# EasyEDA Pro project 一体板.epro, board PCB1
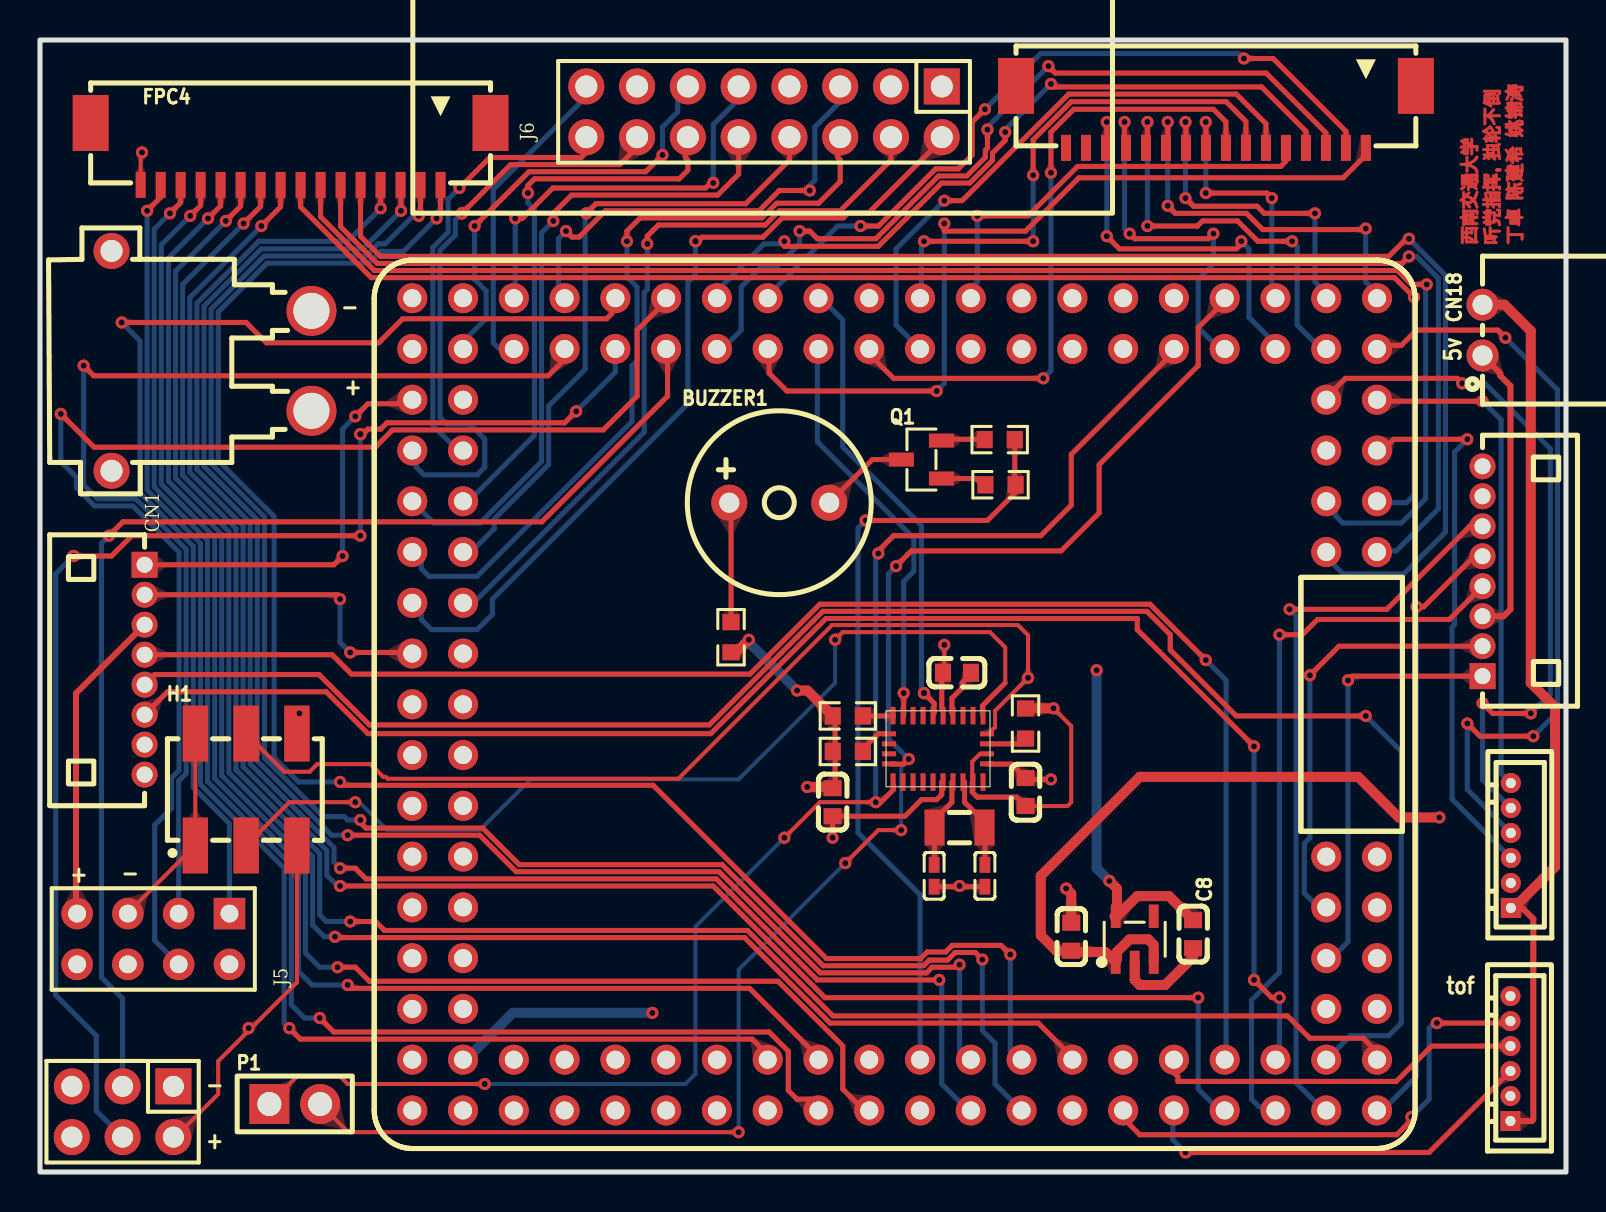
[diagram p7: board, top side]
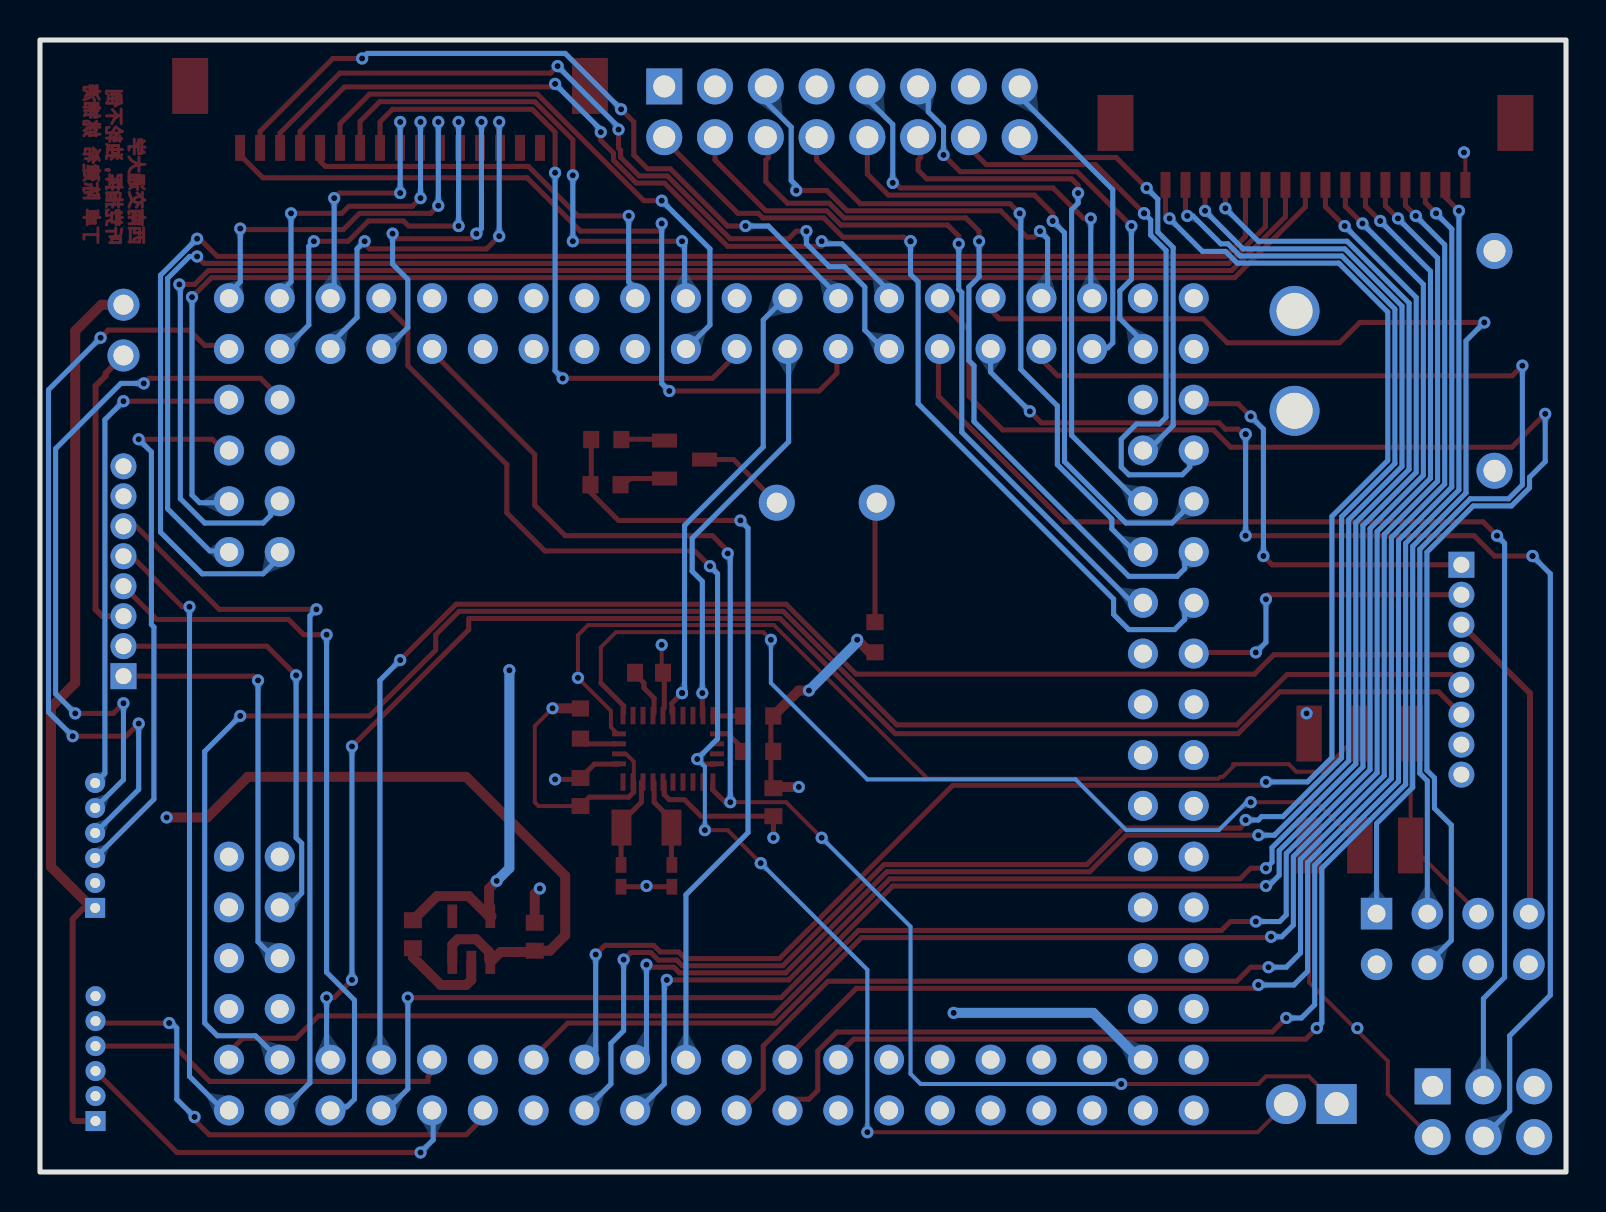
[diagram p8: board, bottom side, seen from below]

Outline 76.34 x 56.64 mm; copper layers: Top Layer, Inner1, Inner2, Bottom Layer. Coordinates in mm from the lower left corner of the outline.
Outline path: rectangle 0,56.64 76.34,0
Stack: Top Layer 0.035mm / Dielectric1 0.48mm PP er 4.5 / Inner1 0.035mm / Dielectric2 0.48mm FR4 er 4.5 / Inner2 0.035mm / Dielectric3 0.48mm PP er 4.5 / Bottom Layer 0.035mm

## Design rules (mm)
template: 自定义配置
spacing copperThickness1oz (default): track to track 0.102, other pairs 0.152 to 0.3
spacing copperThickness2oz: track to track 0.203, other pairs 0.152 to 0.3
track width copperThickness1oz (default): min 0.127, default 0.254, max 2.54
track width copperThickness2oz: min 0.203, default 0.254, max 2.54
differential pair differentialPair (default): width min 0.127, default 0.254, max 2.54; gap min 0.152, default 0.152
via viaSize (default): diameter min 0.5, default 0.61, max 10; hole min 0.3, default 0.305, max 6.3

## Placement (name value [footprint] x y rotation side)
BUZZER1  3kHz  [BUZ-TH_BD9.0-P5.00-D0.6-FD]  36.98 33.49 0 top
C1  22pF  [C0402]  47.27 14.82 90 top
C2  22pF  [C0402]  44.73 14.82 90 top
C3  100nF  [C0603]  45.87 24.98 0 top
C4  100nF  [C0603]  39.65 18.5 270 top
C5  100nF  [C0603]  49.3 19.01 90 top
C7  1uF  [C0603]  51.59 11.77 270 top
C8  1uF  [C0603]  57.68 11.9 270 top
CN1  HC-ZH1.5-8AW  [CONN-TH_8P-P1.50_HCTL_HC-ZH1.5-8AW]  5.23 25.13 270 top
CN6  HC-ZH1.5-8AW  [CONN-TH_8P-P1.50_HCTL_HC-ZH1.5-8AW]  72.16 30.06 90 top
CN13  HC-1.25-6A  [CONN-TH_6P-P1.25_HCTL_HC-1.25-6A]  73.58 16.34 90 top
CN15  HC-1.25-6A  [CONN-TH_6P-P1.25_HCTL_HC-1.25-6A]  73.56 5.68 90 top
CN16  XT30PW-M  [CONN-TH_XT30PW-M]  8.58 40.59 270 top
CN18  XH-2AW  [CONN-TH_XH-2AW_C2908611]  72.16 42.12 90 top
FPC3  F1004-H-16-20G-R  [CONN-SMD_F1004-H-16-20G-R]  58.82 52.79 180 top
FPC4  F1004-H-16-20G-R  [CONN-SMD_F1004-H-16-20G-R]  12.54 50.94 180 top
H1  X6521WVS-2x03H-C60D74  [HDR-SMD_6P-P2.54-V-M-R2-C5-S7.4]  10.31 19.14 0 top
J1  有刷电机编码器  [HDR-TH_6P-P2.54-V-M-R2-C3-S2.54-1]  4.13 3.02 180 top
J5  HDR-M-2.54_2x4  [HDR-M-2.54_2X4]  5.67 11.66 180 top
J6  2.54-2*8P母  [HDR-TH_16P-P2.54-V-F-R2-C8-S2.54-1]  36.22 53.05 180 top
P1  -  [HDR-TH_2P-P2.54-V-F]  12.74 3.4 0 top
Q1  S9013-G  [SOT-23-3_L2.9-W1.3-P1.90-LS2.4-BR]  44.09 35.65 0 top
R4  0603WAF4701T5E  [R0603]  48.05 34.39 180 top
R27  0603WAF100JT5E  [R0603]  34.57 26.76 90 top
R28  10kΩ  [R0603]  48.01 36.65 180 top
R29  2.2kΩ  [R0603]  40.41 22.82 180 top
R30  2.2kΩ  [R0603]  40.41 21.04 180 top
R31  2.2kΩ  [R0603]  49.3 22.44 90 top
U1  TC387核心板 COPY  [TC264逐飞]  37.67 24.04 90 top
U2  -  [lga_28]  47.52 23.07 270 top
U3  RT9013-33GB  [SOT-23-5_L3.0-W1.7-P0.95-LS2.8-BL]  54.76 11.64 0 top
X1  32.768kHz  [FC-135R_L3.2-W1.5]  46 17.23 180 top

## Footprints (pads in the part's own frame, mm; a bottom-side part is the same pattern mirrored in y, then rotated)
BUZ-TH_BD9.0-P5.00-D0.6-FD
  round 1.801 hole 1.001: 1(-2.499,0) 2(2.499,0)
C0402
  rect 0.79x0.54 smd: 1(-0.545,0) 2(0.545,0)
C0603
  rect 0.8x0.9 smd: 1(-0.7,0) 2(0.7,0)
CONN-SMD_F1004-H-16-20G-R
  rect 0.5x1.3 smd: 1(-7.5,1.55) 2(-6.5,1.55) 3(-5.5,1.55) 4(-4.5,1.55) 5(-3.5,1.55) 6(-2.5,1.55) 7(-1.5,1.55) 8(-0.5,1.55) 9(0.5,1.55) 10(1.5,1.55) 11(2.5,1.55) 12(3.5,1.55) 13(4.5,1.55) 14(5.5,1.55) 15(6.5,1.55) 16(7.5,1.55)
  rect 1.8x2.8 smd: 17(10,-1.55) 18(-10,-1.55)
CONN-TH_6P-P1.25_HCTL_HC-1.25-6A
  rect 1x1 hole 0.5: 1(-3.125,0)
  round 1 hole 0.5: 2(-1.875,0) 3(-0.625,0) 4(0.625,0) 5(1.875,0) 6(3.125,0)
CONN-TH_8P-P1.50_HCTL_HC-ZH1.5-8AW
  rect 1.3x1.3 hole 0.8: 1(-5.25,0)
  round 1.3 hole 0.8: 2(-3.75,0) 3(-2.25,0) 4(-0.75,0) 5(0.75,0) 6(2.25,0) 7(3.75,0) 8(5.25,0)
CONN-TH_XH-2AW_C2908611
  round 1.6 hole 1: 1(-1.27,0) 2(1.27,0)
CONN-TH_XT30PW-M
  round 2.5 hole 1.8: 1(-2.5,5) 2(2.5,5)
  round 1.8 hole 1.1: 3(5.5,-5) 4(-5.5,-5)
FC-135R_L3.2-W1.5
  rect 1x1.8 smd: 1(-1.25,0) 2(1.25,0)
HDR-M-2.54_2X4
  rect 1.575x1.575 hole 0.889: 1(-3.81,-1.27)
  round 1.575 hole 0.889: 2(-3.81,1.27) 3(-1.27,-1.27) 4(-1.27,1.27) 5(1.27,-1.27) 6(1.27,1.27) 7(3.81,-1.27) 8(3.81,1.27)
HDR-SMD_6P-P2.54-V-M-R2-C5-S7.4
  rect 1.27x2.8 smd: 1(-2.54,-2.8) 2(-2.54,2.8) 3(0,-2.8) 4(0,2.8) 5(2.54,-2.8) 6(2.54,2.8)
HDR-TH_2P-P2.54-V-F
  rect 1.999x1.999 hole 1.199: 1(-1.27,0)
  round 1.999 hole 1.199: 2(1.27,0)
HDR-TH_6P-P2.54-V-M-R2-C3-S2.54-1
  rect 1.801x1.801 hole 1.049: 1(-2.54,-1.27)
  round 1.801 hole 1.049: 2(-2.54,1.27) 3(0,-1.27) 4(0,1.27) 5(2.54,-1.27) 6(2.54,1.27)
HDR-TH_16P-P2.54-V-F-R2-C8-S2.54-1
  rect 1.8x1.8 hole 1.1: 1(-8.89,-1.27)
  round 1.8 hole 1.1: 2(-8.89,1.27) 3(-6.35,-1.27) 4(-6.35,1.27) 5(-3.81,-1.27) 6(-3.81,1.27) 7(-1.27,-1.27) 8(-1.27,1.27) 9(1.27,-1.27) 10(1.27,1.27) 11(3.81,-1.27) 12(3.81,1.27) 13(6.35,-1.27) 14(6.35,1.27) 15(8.89,-1.27) 16(8.89,1.27)
lga_28
  custom 0.875x0.25 smd: 1(3.562,-0.35) 6(0.237,-0.35) 7(0.237,-0.85) 8(0.237,-1.35) 9(0.237,-1.85) 10(0.237,-2.35) 11(0.237,-2.85) 12(0.237,-3.35) 13(0.237,-3.85) 14(0.237,-4.35) 15(0.237,-4.85) 20(3.562,-4.85) 21(3.562,-4.35) 22(3.562,-3.85) 23(3.562,-3.35) 24(3.562,-2.85) 25(3.562,-2.35) 26(3.562,-1.85) 27(3.562,-1.35) 28(3.562,-0.85)
  custom 0.25x0.7 smd: 2(2.65,-0.15) 3(2.15,-0.15) 4(1.65,-0.15) 5(1.15,-0.15) 16(1.15,-5.05) 17(1.65,-5.05) 18(2.15,-5.05) 19(2.65,-5.05)
R0603
  rect 0.806x0.864 smd: 1(-0.753,0) 2(0.753,0)
SOT-23-3_L2.9-W1.3-P1.90-LS2.4-BR
  rect 1.25x0.7 smd: 1(1,-0.95) 2(1,0.95) 3(-1,0)
SOT-23-5_L3.0-W1.7-P0.95-LS2.8-BL
  rect 0.49x1.157 smd: 1(-0.95,-1.153) 2(0,-1.153) 3(0.95,-1.153)
  rect 0.49x1.175 smd: 4(0.95,1.153) 5(-0.95,1.153)
TC264逐飞
  round 1.5 hole 0.9: 1(-20.955,19.05) 2(-18.415,19.05) 3(-20.955,16.51) 4(-18.415,16.51) 5(-20.955,13.97) 6(-18.415,13.97) 7(-20.955,11.43) 8(-18.415,11.43) 9(-20.955,8.89) 10(-18.415,8.89) 11(-20.955,6.35) 12(-18.415,6.35) 13(-20.955,3.81) 14(-18.415,3.81) 15(-20.955,1.27) 16(-18.415,1.27) 17(-20.955,-1.27) 18(-18.415,-1.27) 19(-20.955,-3.81) 20(-18.415,-3.81) 21(-20.955,-6.35) 22(-18.415,-6.35) 23(-20.955,-8.89) 24(-18.415,-8.89) 25(-20.955,-11.43) 26(-18.415,-11.43) 27(-20.955,-13.97) 28(-18.415,-13.97) 29(-20.955,-16.51) 30(-18.415,-16.51) 31(-20.955,-19.05) 32(-18.415,-19.05) 33(-20.955,-21.59) 34(-18.415,-21.59) 35(-20.955,-24.13) 36(-18.415,-24.13) 37(-20.955,-26.67) 38(-18.415,-26.67) 39(-20.955,-29.21) 40(-18.415,-29.21) 41(-15.875,-29.21) 42(-15.875,-26.67) 43(-13.335,-29.21) 44(-13.335,-26.67) 45(-10.795,-29.21) 46(-10.795,-26.67) 47(-8.255,-29.21) 48(-8.255,-26.67) 49(6.985,-26.67) 50(6.985,-29.21) 51(9.525,-26.67) 52(9.525,-29.21) 53(12.065,-26.67) 54(12.065,-29.21) 55(14.605,-26.67) 56(14.605,-29.21) 57(17.145,-29.21) 58(19.685,-29.21) 59(17.145,-26.67) 60(19.685,-26.67) 61(17.145,-24.13) 62(19.685,-24.13) 63(17.145,-21.59) 64(19.685,-21.59) 65(17.145,-19.05) 66(19.685,-19.05) 67(17.145,-16.51) 68(19.685,-16.51) 69(17.145,-13.97) 70(19.685,-13.97) 71(17.145,-11.43) 72(19.685,-11.43) 73(17.145,-8.89) 74(19.685,-8.89) 75(17.145,-6.35) 76(19.685,-6.35) 77(17.145,-3.81) 78(19.685,-3.81) 79(17.145,-1.27) 80(19.685,-1.27) 81(17.145,1.27) 82(19.685,1.27) 83(17.145,3.81) 84(19.685,3.81) 85(17.145,6.35) 86(19.685,6.35) 87(17.145,8.89) 88(19.685,8.89) 89(17.145,11.43) 90(19.685,11.43) 91(17.145,13.97) 92(19.685,13.97) 93(17.145,16.51) 94(19.685,16.51) 95(17.145,19.05) 96(19.685,19.05) 97(14.605,16.51) 98(14.605,19.05) 99(12.065,16.51) 100(12.065,19.05) 101(9.525,16.51) 102(9.525,19.05) 103(6.985,16.51) 104(6.985,19.05) 105(4.445,16.51) 106(4.445,19.05) 107(1.905,16.51) 108(1.905,19.05) 109(-0.635,16.51) 110(-0.635,19.05) 111(-3.175,16.51) 112(-3.175,19.05) 113(-5.715,16.51) 114(-5.715,19.05) 115(-8.255,16.51) 116(-8.255,19.05) 117(-10.795,16.51) 118(-10.795,19.05) 119(-13.335,16.51) 120(-13.335,19.05) 121(-15.875,16.51) 122(-15.875,19.05)

## Nets
As in the schematic.

Pads without a net: CN15 6; CN16 3 4; FPC3 15 16 17 18; FPC4 17 18; J1 5 6; J5 2 8; J6 7; U1 5 6 7 8 9 10 11 12 13 14 15 20 21 27 30 41 42 43 45 47 48 53 66 67 68 69 70 71 72 73 78 94 95 96 97 107 109 110 111 112 113 114 115 116 117 118 119 120 121 122; U2 1 7 8 12 13 17 18 21 22 23 24; U3 4

## Via types
v1: diameter 0.61, hole 0.305, Top Layer to Bottom Layer, 167 vias

## Routing (per net, layer and track width the routed paths; a pad name or vN(x,y) marks a point on that pad's centre or on a via; arc(x,y) is an arc through that point)
3.3V_LDO: length 212.4
  Top Layer w0.2: v1(50.7,23.2) 51.59,22.31 51.59,18.5 51.39,18.31 C5.1 ; v1(12.98,22.95) 12.98,22.06 H1.6 ; 7.01,1.99 8.91,3.9 8.91,5.55 12.85,9.49 H1.5 ; 46.63,19.65 46.63,20.53 47.01,20.92 47.39,20.92
  Top Layer w0.254: 39.77,22.95 39.77,19.33 C4.1 ; C5.1 48.85,18.76 46.89,18.76 46.63,19.01 46.63,19.52
  Top Layer w0.3: CN15.1 74.62,2.55 74.7,2.63 74.7,12.66 74.19,13.17 73.68,13.17
  Top Layer w0.5: v1(38.38,19.26) 39.59,19.26 C4.1 ; CN18.2 73.26,43.39 74.57,42.08 74.57,24.47 75.79,23.26 75.79,15.27 73.81,13.3 ; v1(50.7,23.2) 49.3,23.2 ; 34.57,25.87 34.69,25.87 v1(35.46,26.63) ; v1(37.87,24.09) 38.39,24.09 R29.2
  Inner1 w0.2: v1(12.98,22.95) 12.98,9.74 v1(10.44,7.2)
  Inner1 w0.5: 6.63,1.74 7.26,1.1 26.82,1.1 27.58,1.87 27.58,8.47 v1(38.38,19.26) 42.06,22.95 46.38,22.95 46.76,22.57 47.65,22.57 48.28,23.2 v1(50.7,23.2)
  Inner1 w0.8: CN18.2 73.26,43.39 74.39,42.26 74.39,24.54 73.56,23.71 73.56,21.68 72.03,20.15 57.81,20.15 54.76,23.2 v1(50.7,23.2)
  Bottom Layer w0.5: v1(37.87,24.09) 35.46,26.5 v1(35.46,26.63)
3.3V_LDO_CAMERA: length 51.3
  Top Layer w0.5: C8.1 56.48,13.8 54.89,13.8 53.87,12.79 53.74,12.79 ; v1(53.49,14.57) 53.87,14.18 53.87,13.04
  Inner1 w0.5: v1(52.86,25.11) 52.86,44.92 52.35,45.43 52.35,49.74 47.78,54.32 J6.1
  Bottom Layer w0.5: v1(52.86,25.11) 52.86,15.2 v1(53.49,14.57)
5V_DCDC: length 289.5
  Top Layer w0.3: 1.8,12.66 1.8,23.95 CN1.3 ; CN6.3 73.21,27.81 73.56,28.15 73.56,39.33 73.05,39.84 73.05,39.97 72.41,40.6
  Top Layer w0.5: U3.1 53.29,11.01 51.71,11.01 ; v1(70,17.74) 67.97,17.74 65.94,19.77 55.01,19.77 50.06,14.82 50.06,11.84 50.83,11.07 C7.2 ; 53.87,10.63 53.87,11.01 54.51,11.64 55.44,11.64 55.71,11.37 U3.3
  Inner1 w0.5: 2.31,12.66 3.2,11.77 3.2,7.71 5.29,5.62 U1.2 21.11,5.62 ; 21.09,5.55 U1.4 21.11,5.68
  Inner1 w0.8: v1(30.63,7.96) 30.93,7.96 34.94,11.97 56.86,11.97 62.63,17.74 v1(70,17.74)
  Inner2 w0.5: CN18.1 71.65,40.85 70.37,42.13 70.37,46.7 69.24,47.84 68.35,47.84 66.83,46.32 66.83,45.43 52.6,45.43 48.41,49.62 45.11,49.62 43.84,48.35 30.63,48.35 28.98,50 2.56,50 1.17,48.6 1.17,39.71 2.18,38.7 2.18,37.04 0.91,35.77 0.91,13.87 J5.7
  Inner2 w0.8: CN18.1 75.64,37.38 75.64,20.52 72.14,20.52 71.02,19.39 71.02,18.76 v1(70,17.74)
  Bottom Layer w0.5: 21.36,5.68 23.65,7.96 v1(30.63,7.96)
GND: length 37.5
  Top Layer w0.2: C3.1 45.24,25.04 v1(45.24,26.38) ; H1.1 7.77,16.34 ; 7.77,16.34 4.4,12.97 J5.5 ; 7.77,16.34 7.77,21.8 ; FPC4.16 5.04,50.95 v1(5.1,51.01)
  Top Layer w0.254: C2.1 47.18,14.27 47.27,14.18 ; 45.11,36.66 47.24,36.66 R28.2 ; 45.11,23.2 45.11,24.98 ; 47.39,20.41 48.6,20.41 C5.2 49.36,19.65 v1(50.57,19.65) ; 45.11,19.52 45.11,18.88 44.85,18.63 44.09,18.63 43.27,17.8 C4.2 v1(39.65,16.72)
  Top Layer w0.5: C7.1 51.59,13.93 v1(51.33,14.18) ; 57.68,11.01 57.68,10.76 56.28,9.36 55.01,9.36 54.76,9.61 U3.2
  vias: v1(46,14.31)
10.2: length 67.8
  Top Layer w0.254: 31.14,43.39 29.87,42.12 29.87,38.82 28.18,37.13 17.63,37.13 16.77,36.26 2.71,36.26 v1(1.04,37.93)
  Bottom Layer w0.254: v1(1.04,37.93) 1.04,35.55 1.83,34.76 1.83,34.23 2.73,33.33 4.64,33.33 6.96,31.01 6.96,20.1 6.58,19.72 6.58,18.2 5.74,17.36 5.74,11.59 v1(6.94,10.39)
10.5: length 57.9
  Top Layer w0.254: v1(4.09,42.51) 10.31,42.51 11.33,41.49 16.94,41.49 18.15,42.69 28.34,42.69 28.6,42.95 28.6,43.52
  Bottom Layer w0.254: v1(4.09,42.51) 5,41.59 5,33.98 7.67,31.31 7.67,19.24 9.48,17.44 v1(9.48,12.93)
10.6: length 55.2
  Top Layer w0.254: v1(2.18,40.35) 2.69,39.84 25.42,39.84 26.06,40.47
  Bottom Layer w0.254: v1(2.18,40.35) 2.18,34.38 2.88,33.68 4.79,33.68 7.31,31.16 7.31,19.95 6.94,19.57 v1(6.94,12.93)
20.11: length 27.1
  Top Layer w0.254: v1(71.4,36.66) 67.71,36.66 67.08,36.03
  Bottom Layer w0.254: v1(71.4,36.66) 70.76,36.03 70.76,27.39 70.64,27.27 70.64,18.65 v1(73.58,15.71)
20.12: length 35.4
  Top Layer w0.254: 64.16,38.57 65.3,39.71 70.89,39.71 v1(71.14,39.46) ; v1(72.16,23.46) 72.67,22.95 v1(74.57,22.95)
  Bottom Layer w0.254: v1(72.16,23.46) 72.16,19.63 v1(73.58,18.21) ; v1(71.14,39.46) 72.29,39.46 75.55,36.19 75.55,23.93 v1(74.57,22.95)
20.13: length 24.8
  Top Layer w0.254: v1(72.16,38.57) 67.08,38.57
  Bottom Layer w0.254: CN13.6 73.09,19.95 73.09,37.64 v1(72.16,38.57)
20.14: length 38.2
  Top Layer w0.254: 67.08,41.36 68.1,41.36 68.86,42.12 72.92,42.12 v1(73.3,41.74) ; v1(71.4,22.44) 72.03,21.8 v1(74.7,21.8)
  Bottom Layer w0.254: v1(71.4,22.44) 71.4,19.14 v1(73.58,16.96) ; v1(73.3,41.74) 75.91,39.14 75.91,23.01 v1(74.7,21.8)
A2: length 74.6
  Top Layer w0.254: v1(8.41,47.71) 9.04,48.34 FPC4.12 ; 41.04,3.26 40.16,4.15 40.16,6.31 36.92,9.55 16.47,9.55 15.77,10.25 v1(14.88,10.25)
  Bottom Layer w0.254: v1(8.41,47.71) 6.42,45.73 6.42,34.57 9.09,31.9 9.09,19.83 13.28,15.64 13.28,10.96 13.99,10.25 v1(14.88,10.25)
A3: length 70.4
  Top Layer w0.254: FPC4.13 8.04,48.36 v1(7.52,47.84) ; 38.63,6.06 35.5,9.19 15.56,9.19 v1(15.39,9.36)
  Bottom Layer w0.254: v1(7.52,47.84) 6.07,46.39 6.07,34.42 8.74,31.75 8.74,19.69 12.93,15.5 12.93,10.04 13.61,9.36 v1(15.39,9.36)
A4: length 73.6
  Top Layer w0.254: FPC4.14 7.04,48.5 v1(6.5,47.97) ; 38.63,3.64 37.87,3.64 37.43,4.08 37.43,6.05 36.47,7.01 14.7,7.01 v1(13.99,7.71)
  Bottom Layer w0.254: v1(6.5,47.97) 5.71,47.18 5.71,34.27 8.38,31.6 8.38,19.54 12.57,15.35 12.57,8.37 13.23,7.71 v1(13.99,7.71)
A5: length 69.8
  Top Layer w0.254: 36.35,6.06 36.22,6.06 35.63,6.65 13.02,6.65 v1(12.47,7.2) ; v1(5.36,48.09) 6.04,48.77 FPC4.15
  Bottom Layer w0.254: v1(5.36,48.09) 5.36,34.12 8.02,31.46 8.02,19.39 12.22,15.2 12.22,7.45 v1(12.47,7.2)
A_PIN_B: length 21.5
  Top Layer w0.254: v1(63.52,24.85) 64.98,26.31 v1(72.16,26.31)
  Bottom Layer w0.254: v1(63.52,24.85) 63.52,16.72 63.24,16.45 63.24,13.96 64.16,13.04
A_PIN_F: length 16
  Top Layer w0.254: v1(15.52,26) 18.69,26 ; CN1.2 14.92,28.88 15.01,28.79 v1(15.01,28.66)
  Bottom Layer w0.254: v1(15.01,28.66) 15.01,26.5 v1(15.52,26)
B_PIN_B: length 20.8
  Top Layer w0.254: v1(65.43,24.6) 65.64,24.81 v1(72.16,24.81)
  Bottom Layer w0.254: 64.79,10.88 65.43,11.52 v1(65.43,24.6)
B_PIN_F: length 20
  Top Layer w0.254: 18.18,38.44 16.41,38.44 v1(15.77,37.81) ; v1(15.14,30.82) 14.7,30.38 CN1.1
  Bottom Layer w0.254: v1(15.77,37.81) 15.14,37.17 v1(15.14,30.82)
BL_IPS: length 12.9
  Top Layer w0.254: FPC3.9 58.32,52.53 v1(58.32,52.54) ; v1(58.32,48.98) 61.36,48.98 v1(61.62,48.73)
  Bottom Layer w0.254: 61.87,44.16 61.62,44.41 v1(61.62,48.73) ; v1(58.32,48.98) v1(58.32,52.54)
BNO_NRST: length 23
  Top Layer w0.254: 44.73,22.95 44.73,23.46 v1(44.22,23.96)
  Bottom Layer w0.254: v1(44.22,23.96) 44.09,24.09 44.09,32.35 40.16,36.28 40.16,42.63 39.14,43.65
BUZZER_PIN: length 38.7
  Top Layer w0.254: 48.66,34.63 48.76,34.73 R28.1 ; 48.92,34.12 47.39,32.6 v1(41.3,32.6)
  Bottom Layer w0.254: v1(44.02,5.62) 44.02,13.87 40.92,16.98 40.92,32.22 v1(41.3,32.6)
CS_IPS: length 16.1
  Top Layer w0.254: FPC3.10 57.32,52.51 v1(57.3,52.54) ; v1(63.78,47.97) 61.24,47.97 60.88,48.32 57.71,48.32 v1(57.3,48.73)
  Bottom Layer w0.254: v1(57.3,52.54) v1(57.3,48.73) ; 64.29,44.03 63.78,44.54 v1(63.78,47.97)
D0_CAM: length 42
  Top Layer w0.254: v1(45.11,51.65) 41.43,47.97 40.41,47.97 40.18,47.74 37.13,47.74 36.16,46.77 33.12,46.77 32.92,46.57
  Bottom Layer w0.254: v1(32.79,46.57) 32.79,44.92 32.41,44.54 32.41,38.44 22.63,28.66 22.63,27.9 21.87,27.14 19.58,27.14 19.07,27.65 19.07,28.41
D0_IPS: length 41.6
  Top Layer w0.254: v1(45.24,47.46) 45.24,47.08 49.3,47.08 51.97,49.74 65.19,49.74 66.32,50.88 FPC3.1 ; v1(44.85,39.08) 37.36,39.08 36.47,39.97 36.47,40.47 36.22,40.73
  Bottom Layer w0.254: v1(44.85,39.08) 45.24,39.46 v1(45.24,47.46)
D1_CAM: length 36.8
  Top Layer w0.254: 42.57,51.65 42.57,50.63 40.03,48.09 36.98,48.09 36.27,47.38 30.94,47.38 30.38,46.82 v1(30.38,46.44)
  Bottom Layer w0.254: v1(30.38,46.44) 30.38,44.16 30.22,44 30.22,37.02 21.74,28.54 21.61,28.54
D1_IPS: length 37.1
  Top Layer w0.254: FPC3.2 65.32,52.07 61.68,55.71 v1(60.22,55.71) ; v1(47.27,53.17) 46.63,52.54 46.63,50.89 45.94,50.19 44.8,50.19 41.94,47.33 v1(41.04,47.33)
  Bottom Layer w0.254: 36.6,44.03 39.9,47.33 v1(41.04,47.33) ; v1(47.27,53.17) 50.06,55.97 59.97,55.97 v1(60.22,55.71)
D2_CAM: length 38.5
  Top Layer w0.254: v1(29.36,46.57) 29.36,47.08 30.02,47.74 36.11,47.74 36.85,48.47 38.95,48.47 40.03,49.56 40.03,50.63 39.9,50.76 39.9,51.65
  Bottom Layer w0.254: v1(29.36,46.57) 29.36,44.79 29.87,44.28 29.87,40.6 29.61,40.35 29.61,37.55 21.87,29.81 19.45,29.81 19.07,30.19 19.07,30.69 18.82,30.95
D2_IPS: length 40.7
  Top Layer w0.254: FPC3.3 64.32,51.99 61.33,54.98 50.79,54.98 v1(50.44,55.33) ; v1(38,47.08) 38.5,47.08 38.89,46.7 41.81,46.7 44.95,49.84 46.36,49.84 47.29,50.77 47.29,51.13 47.39,51.23 v1(47.39,52.16)
  Bottom Layer w0.254: v1(50.44,55.33) 47.39,52.28 v1(47.39,52.16) ; v1(38,47.08) 38,46.44 36.85,45.3 36.09,45.3 35.08,44.28 35.08,42.12 34.31,41.36
D3_CAM: length 31.1
  Top Layer w0.254: v1(27.33,47.97) 27.81,48.45 35.3,48.45 37.49,50.63 37.49,51.4
  Bottom Layer w0.254: v1(27.33,47.97) 27.27,47.91 27.27,40.16 25.44,38.33 25.44,35.4 22.72,32.67 22.72,32.18 21.74,31.2
D3_IPS: length 36.3
  Top Layer w0.254: v1(50.57,54.44) 50.72,54.29 61.1,54.29 63.32,52.07 FPC3.4 ; v1(37.23,46.57) 37.23,46.32 41.93,46.32 45.1,49.48 46.51,49.48 47.65,50.62 47.65,50.98 48.28,51.62 v1(48.28,52.03)
  Bottom Layer w0.254: 33.93,44.16 36.22,46.44 37.11,46.44 v1(37.23,46.57) ; v1(50.57,54.44) 48.28,52.16 v1(48.28,52.03)
D4_CAM: length 32
  Top Layer w0.254: 34.95,51.27 34.95,49.93 33.9,48.88 26.59,48.88 25.68,47.97 v1(25.68,47.59)
  Bottom Layer w0.254: 18.82,33.36 19.71,32.47 22.02,32.47 25.09,35.54 25.09,47 v1(25.68,47.59)
D4_IPS: length 21.1
  Top Layer w0.254: FPC3.5 62.32,50.58 62.06,50.31 51.9,50.31 49.43,47.84 v1(46.89,47.84)
  Bottom Layer w0.254: 46.51,44.16 46.89,44.54 v1(46.89,47.84)
D5_CAM: length 26.9
  Top Layer w0.254: 32.28,51.65 32.28,50.76 32.41,50.63 32.41,50.13 31.98,49.69 24.74,49.69 24.41,49.36 v1(24.41,48.98)
  Bottom Layer w0.254: 21.61,33.74 24.73,36.86 24.73,48.15 24.41,48.47 v1(24.41,48.98)
D5_IPS: length 28.8
  Top Layer w0.254: FPC3.6 61.32,52.45 59.84,53.94 51.46,53.94 46.13,48.6 v1(45.24,48.6)
  Bottom Layer w0.254: 43.84,41.36 42.82,42.38 42.82,46.19 v1(45.24,48.6)
D6_CAM: length 29.3
  Top Layer w0.254: v1(21.11,47.97) 23.54,50.41 29,50.41 29.87,51.27
  Bottom Layer w0.254: v1(21.11,47.97) 20.78,47.64 20.78,46.88 20.01,46.11 20.01,37.76 20.34,37.43 21.49,37.43 22.25,36.66 22.25,35.27 21.87,34.89 19.2,34.89 18.82,35.27 18.82,35.9
D6_IPS: length 26.8
  Top Layer w0.254: v1(49.68,46.57) v1(44.22,46.57) ; v1(49.68,49.87) 49.68,51.65 51.59,53.55 59.33,53.55 60.32,52.56 FPC3.7
  Bottom Layer w0.254: v1(44.22,46.57) 44.09,46.44 44.09,43.52 ; v1(49.68,49.87) v1(49.68,46.57)
D7_CAM: length 22.8
  Top Layer w0.254: v1(20.98,49.24) 22.5,50.76 27.07,50.76 27.96,51.65 27.46,51.65 J6.16
  Bottom Layer w0.254: v1(20.98,49.24) 20.42,48.68 20.42,47.03 19.65,46.26 19.65,37.36 20.85,36.16
D7_IPS: length 32.2
  Top Layer w0.254: 41.68,40.73 42.7,39.71 v1(50.19,39.71) ; FPC3.8 59.32,52.55 58.7,53.17 51.71,53.17 50.57,52.03 v1(50.57,50)
  Bottom Layer w0.254: v1(50.19,39.71) 50.57,40.09 v1(50.57,50)
DIR_BRUSHED_MOTOR: length 91.2
  Top Layer w0.254: FPC4.9 12.04,48.29 v1(11.07,47.33) ; v1(15.01,14.31) 33.68,14.31 39.27,8.72 v1(57.94,8.72)
  Bottom Layer w0.254: v1(15.01,14.31) 14.88,14.31 14.35,14.85 14.35,16.08 10.16,20.27 10.16,32.34 7.49,35.01 7.49,43.75 v1(11.07,47.33) ; v1(57.94,8.72) 57.94,4.15 58.82,3.26
DIR_ENCODER: length 65.9
  Top Layer w0.254: v1(26.82,38.06) 26.25,37.49 17.36,37.49 17.04,37.17 16.41,37.17 16.03,36.79 ; v1(16.03,31.84) 4.6,31.84 3.58,30.82 v1(1.67,30.82)
  Bottom Layer w0.254: v1(1.67,30.82) 0.79,29.93 0.79,8.85 2.82,6.82 2.82,3.06 v1(4.13,1.75) ; v1(26.82,38.06) 28.78,40.02 U1.87 ; v1(16.03,36.92) v1(16.03,31.84)
DIR_PIN_B: length 36.2
  Top Layer w0.254: v1(72.16,29.31) 70.5,27.65 63.9,27.65 63.14,26.88 v1(62,26.88)
  Bottom Layer w0.254: 61.62,3.26 60.98,3.26 60.6,3.64 60.6,8.6 62,9.99 v1(62,26.88)
DIR_PIN_F: length 75.9
  Top Layer w0.254: CN1.4 14.61,25.88 15.59,24.91 35.52,24.91 39.01,28.41 55.52,28.41 v1(58.32,25.61)
  Bottom Layer w0.254: v1(58.32,25.61) 59.33,24.6 59.33,6.18
DL1A_SCL: length 20.2
  Top Layer w0.254: CN15.3 69.48,0.98 v1(57.3,0.98)
  Bottom Layer w0.254: v1(57.3,0.98) 56.67,1.61 56.67,3.01
DL1A_SDA: length 18.2
  Top Layer w0.254: 56.54,5.17 56.92,4.79 56.92,4.53 67.84,4.53 69.61,6.3 CN15.4
DL1A_XSHUT: length 24.5
  Top Layer w0.254: v1(69.87,7.45) 73.68,7.45 ; 54.51,3.01 54.51,2.37 55.01,1.87 67.87,1.87 68.6,2.6 v1(68.6,2.75)
  Bottom Layer w0.254: v1(68.6,2.75) 69.49,3.64 69.49,7.2 69.75,7.45 v1(69.87,7.45)
HOST_INTN: length 20.1
  Top Layer w0.254: 43.2,22.82 v1(43.2,23.96)
  Bottom Layer w0.254: 38.89,40.73 38.89,36.54 43.71,31.71 43.71,30.06 43.2,29.55 v1(43.2,23.96)
KEY_1: length 84.9
  Top Layer w0.254: v1(15.01,19.52) 15.18,19.35 30.67,19.35 39.34,10.68 44.05,10.68 44.38,11.01 45.3,11.01 45.63,11.34 48.08,11.34 v1(48.54,10.88) ; v1(19.84,47.71) 20.04,47.91 FPC4.1
  Bottom Layer w0.254: 48.92,5.68 48.54,6.06 v1(48.54,10.88) ; v1(15.01,19.52) 12.93,19.52 11.71,20.74 11.71,32.8 8.92,35.6 8.92,43.03 11.36,45.48 16.45,45.48 17.03,46.06 18.18,46.06 v1(19.84,47.71)
KEY_2: length 85.9
  Top Layer w0.254: FPC4.2 19.04,47.93 v1(18.95,47.84) ; v1(47.14,10.63) 46.78,10.98 45.78,10.98 45.4,10.6 44.48,10.6 44.2,10.32 39.18,10.32 34.12,15.38 23.97,15.38 22.14,17.21 16.3,17.21 16.03,17.49 v1(16.03,17.61)
  Bottom Layer w0.254: v1(47.14,10.63) 47.14,7.07 47.78,6.44 47.78,4.41 48.66,3.52 ; v1(16.03,17.61) 15.39,17.61 15.22,17.78 14.16,17.78 11.23,20.72 11.23,32.78 8.56,35.45 8.56,43.18 11.22,45.83 16.3,45.83 16.91,46.44 17.27,46.44 18.67,47.84 v1(18.95,47.84)
KEY_3: length 81.4
  Top Layer w0.254: v1(18.06,48.09) 18.06,49.37 FPC4.3 ; v1(15.39,16.85) 21.99,16.85 23.82,15.02 33.97,15.02 39.03,9.97 44.35,9.97 44.63,10.25 45.87,10.25 v1(46,10.37)
  Bottom Layer w0.254: 46.25,5.8 46,6.06 v1(46,10.37) ; v1(18.06,48.09) 16.15,46.19 11.07,46.19 8.2,43.33 8.2,35.3 10.87,32.64 10.87,20.57 14.59,16.85 v1(15.39,16.85)
KEY_4: length 82.6
  Top Layer w0.254: 44.98,9.61 38.88,9.61 33.83,14.67 16.3,14.67 15.77,15.2 v1(15.01,15.2) ; FPC4.4 17.04,49.38 v1(17.04,48.22)
  Bottom Layer w0.254: v1(44.98,9.61) 45.11,9.49 45.11,4.41 46.12,3.39 ; v1(15.01,15.2) 14.71,15.51 14.71,16.23 10.52,20.42 10.52,32.49 7.85,35.16 7.85,43.47 10.95,46.57 15.39,46.57 v1(17.04,48.22)
KEY_5: length 78.5
  Top Layer w0.254: FPC4.5 16.04,46.81 17.03,45.82 67.47,45.82 68.35,46.7 v1(68.48,46.7)
  Bottom Layer w0.254: 64.29,30.82 65.17,29.93 68.22,29.93 70.31,32.02 70.31,44.87 v1(68.48,46.7)
KEY_6: length 73.6
  Top Layer w0.254: v1(68.48,45.81) 68.13,45.46 16.87,45.46 15.04,47.3 FPC4.6
  Bottom Layer w0.254: 67.08,31.08 67.84,31.08 69.95,33.18 69.95,44.72 68.86,45.81 v1(68.48,45.81)
KEY_7: length 75
  Top Layer w0.254: v1(69.37,44.41) 68.6,44.41 67.9,45.11 16.72,45.11 14.04,47.79 FPC4.7
  Bottom Layer w0.254: 64.41,33.49 64.79,33.11 64.79,32.85 65.17,32.47 68.1,32.47 69.31,33.69 69.31,44.36 v1(69.37,44.41)
KEY_8: length 70.3
  Top Layer w0.254: FPC4.8 13.04,48.29 16.58,44.75 67.76,44.75 v1(68.73,43.78)
  Bottom Layer w0.254: 67.21,33.49 68.35,33.49 68.73,33.87 v1(68.73,43.78)
LSB_ENCODER: length 61.1
  Top Layer w0.254: 31.39,40.98 31.39,38.82 25.1,32.53 4.15,32.53 v1(3.45,31.84)
  Bottom Layer w0.254: v1(3.45,31.84) 3.07,31.46 3.07,9.74 4.13,8.68 J1.3
PCLK_CAM: length 15.1
  Bottom Layer w0.254: 23.39,41.24 22.93,41.24 22.67,41.49 22.67,49.15 27.33,53.81
PS0: length 48.9
  Top Layer w0.2: v1(15.77,18.5) 12.48,18.5 H1.3 ; 48.28,24.47 48.28,26.25 47.52,27.01 40.16,27.01 v1(39.77,26.63)
  Top Layer w0.254: 47.14,22.95 47.14,23.33 48.28,24.47
  Bottom Layer w0.2: v1(15.77,18.5) 15.97,18.5 17.37,17.11 21.99,17.11 24.53,19.65 34.95,19.65 39.77,24.47 v1(39.77,26.63)
PS1: length 49.7
  Top Layer w0.2: H1.4 12.22,20.03 13.49,20.03 13.87,20.41 16.53,20.41 ; 47.39,21.93 47.45,21.93 47.78,22.26 47.78,23.07 v1(49.43,24.73) 49.43,26.86 48.92,27.37 39.62,27.37 31.93,19.68 17.39,19.68 17.3,19.77 17.17,19.77 16.53,20.41 ; 16.53,20.41 16.66,20.41
PWM_BRUSHED_MOTOR: length 96.8
  Top Layer w0.254: v1(15.52,12.53) 16.79,12.53 17.24,12.09 35.39,12.09 39.67,7.81 62.41,7.81 63.52,6.69 66.19,6.69 66.83,6.06 66.95,6.06 ; v1(10.18,47.46) 11.04,48.31 FPC4.10
  Bottom Layer w0.254: v1(10.18,47.46) 7.14,44.41 7.14,34.86 9.8,32.19 9.8,20.13 13.99,15.94 13.99,12.86 14.32,12.53 v1(15.52,12.53)
PWM_PIN_B: length 30
  Top Layer w0.254: v1(72.16,30.81) 71.74,30.81 69.22,28.28 v1(68.86,28.28)
  Bottom Layer w0.254: v1(68.86,28.28) 68.86,4.79 67.33,3.26
PWM_PIN_F: length 87.8
  Top Layer w0.254: v1(5.23,24.38) 5.74,24.89 13.95,24.89 16.47,22.37 33.48,22.37 39.16,28.05 55.37,28.05 56.54,26.88 56.54,26.12 59.84,22.82 v1(66.32,22.82)
  Bottom Layer w0.254: 64.41,5.68 65.56,6.82 67.46,6.82 68.1,7.45 68.1,21.04 v1(66.32,22.82)
RDV_IPS: length 20.2
  Top Layer w0.254: v1(60.09,46.57) 60.09,46.44 59.84,46.19 54,46.19 v1(53.36,46.82) ; v1(53.36,52.54) 53.36,51.28 FPC3.14
  Bottom Layer w0.254: 61.87,41.36 60.48,42.76 60.48,46.19 v1(60.09,46.57) ; v1(53.36,52.54) v1(53.36,46.82)
RS_IPS: length 20.5
  Top Layer w0.254: v1(55.4,47.33) 57.9,47.33 58.16,47.59 59.9,47.59 60.92,46.57 v1(62.63,46.57) ; FPC3.12 55.4,51.31 v1(55.4,52.54)
  Bottom Layer w0.254: 64.41,41.36 63.9,41.36 62.89,42.38 62.89,46.32 v1(62.63,46.57) ; v1(55.4,52.54) v1(55.4,47.33)
RST_IPS: length 19.3
  Top Layer w0.254: v1(66.32,47.2) 66.27,47.15 61.16,47.15 60.35,47.97 56.79,47.97 v1(56.41,48.35) ; v1(56.41,52.54) 56.41,51.33 FPC3.11
  Bottom Layer w0.254: v1(56.41,52.54) v1(56.41,48.35) ; v1(66.32,47.2) 66.32,44.54 66.83,44.03
RXD_CAM: length 19.5
  Top Layer w0.254: v1(23.77,47.71) 24.13,47.71 25.66,49.24 33.3,49.24 33.55,49.49 v1(33.68,49.49)
  Bottom Layer w0.254: v1(23.77,47.71) 23.77,43.78 ; v1(33.68,49.49) 33.68,52.41 34.83,53.57 34.83,53.92 34.82,53.94
STEERING_1: length 81.7
  Top Layer w0.254: v1(9.29,47.59) 10.04,48.33 FPC4.11 ; v1(14.76,11.77) 14.8,11.73 35.24,11.73 39.52,7.45 49.93,7.45 51.46,5.93
  Bottom Layer w0.254: v1(14.76,11.77) 14.22,11.77 13.64,12.36 13.64,15.79 9.45,19.98 9.45,32.05 6.78,34.71 6.78,45.07 v1(9.29,47.59)
STOP_PIN_B: length 37.1
  Top Layer w0.254: v1(62.51,28.15) 67.37,28.15 71.52,32.31 CN6.6
  Bottom Layer w0.254: 64.16,3.14 62.83,4.46 62.83,27.83 v1(62.51,28.15)
STOP_PIN_F: length 78.7
  Top Layer w0.254: v1(60.73,21.3) 54.89,27.14 54.89,27.7 39.32,27.7 33.55,21.93 16.41,21.93 14.32,24.03 6.38,24.03 v1(5.23,22.88) ; v1(60.73,9.61) 61.62,8.72 v1(62,8.72)
  Bottom Layer w0.254: v1(62,8.72) 62,6.06 61.62,5.68 ; v1(60.73,21.3) v1(60.73,9.61)
TXD_CAM: length 20.9
  Top Layer w0.254: v1(31.14,50.89) 30.3,50.05 24.46,50.05 v1(21.74,47.33)
  Bottom Layer w0.254: v1(31.14,50.89) 31.14,52.28 31.9,53.05 31.9,53.68 32.28,54.06 ; 21.23,41.62 22.32,42.7 22.32,44.09 21.74,44.66 v1(21.74,47.33)
UART3_RX: length 75.4
  Top Layer w0.2: P1.1 12.86,4.79 15.01,4.79 15.39,4.41 v1(22.25,4.41) ; v1(37.23,16.72) 39.01,18.5 v1(41.81,18.5)
  Top Layer w0.254: 56.54,40.85 51.59,35.9 51.59,33.36 50.06,31.84 42.7,31.84 41.93,31.08 v1(41.93,30.95) ; 42.7,19.39 42.7,19.14 42.06,18.5 v1(41.81,18.5)
  Bottom Layer w0.2: v1(37.23,16.72) 32.79,12.28 32.79,4.91 32.28,4.41 v1(22.25,4.41)
  Bottom Layer w0.254: v1(41.93,30.95) 41.81,30.82 v1(41.81,18.5)
UART3_TX: length 79.8
  Top Layer w0.2: P1.2 15.42,1.99 v1(34.95,1.99) ; v1(40.28,15.45) 41.93,17.11 v1(43.08,17.11)
  Top Layer w0.254: v1(42.82,30.31) 43.58,31.08 51.08,31.08 52.98,32.98 52.98,35.39 57.94,40.35 57.94,42.25 59.08,43.39 ; 42.57,20.41 43.2,20.41 v1(43.46,20.66)
  Bottom Layer w0.2: v1(43.08,17.11) 43.08,20.28 v1(43.46,20.66) ; v1(34.95,1.99) 34.95,10.12 v1(40.28,15.45)
  Bottom Layer w0.254: v1(42.82,30.31) 42.44,29.93 42.44,21.68 v1(43.46,20.66)
VSY_CAM: length 22.6
  Top Layer w0.254: v1(38.5,49.11) 36.98,49.11 35.96,48.09 28.28,48.09 26.97,46.78 26.61,46.78 v1(26.31,47.08)
  Bottom Layer w0.254: 40.16,54.06 40.16,53.68 38.76,52.28 38.76,49.62 38.5,49.36 v1(38.5,49.11) ; 25.93,43.52 25.93,46.7 v1(26.31,47.08)
WR_IPS: length 17.9
  Top Layer w0.254: v1(54.25,52.54) 54.25,51.31 FPC3.13 ; v1(54.51,46.95) 54.76,46.7 58.44,46.7 v1(58.7,46.95)
  Bottom Layer w0.254: v1(54.25,52.54) 54.25,47.2 v1(54.51,46.95) ; 58.95,41.24 57.94,42.25 57.94,44.66 58.7,45.43 v1(58.7,46.95)
$1N3896: length 2.2
  Top Layer w0.254: Q1.1 46.82,34.7 47.14,34.38
$1N3898: length 5.9
  Top Layer w0.254: R27.2 34.57,33.36
$1N3899: length 4.2
  Top Layer w0.254: 42.82,35.65 41.64,35.65 BUZZER1.2
$1N12778: length 3.8
  Top Layer w0.254: 44.98,17.87 45.62,18.5 45.62,19.52 ; X1.2 44.75,15.6 44.6,15.45
$1N12786: length 3.8
  Top Layer w0.254: 47.27,15.33 47.27,17.21 X1.1 ; 46.25,19.52 46.25,18.5 46.89,17.87
$1N12868: length 2.3
  Top Layer w0.254: 45.62,22.95 45.62,23.71 46.12,24.22 46.12,24.47 46.51,24.85
$1N13403: length 1.5
  Top Layer w0.254: R29.1 42.7,22.82
$1N13442: length 1.3
  Top Layer w0.254: 41.3,21.3 41.93,21.93 42.31,21.93
$1N13483: length 1.9
  Top Layer w0.254: R31.1 49.04,21.42 47.52,21.42

## Copper pours and planes (outline as drawn; the poured copper is in the pictures)
3.3V_LDO on Inner1: 153.38,-39.6 -0.93,-39.6 -0.93,77.62 153.38,77.62
GND on Top Layer: -49.63,85.18 104.67,85.18 104.67,-32.04 -49.63,-32.04
GND on Bottom Layer: -22.65,-84.68 -22.65,69.62 94.58,69.62 94.58,-84.68
VCC_BAT on Inner2: -9.31,-16.87 -9.31,137.44 107.91,137.44 107.91,-16.87

Small or netless copper shapes (teardrops, artwork), in the pictures only: 284 on Top Layer, 199 on Bottom Layer, 9 on Inner1, 3 on Inner2

## Text on the board
Top Layer: 西南交通大学 / 听党指挥，独轮不倒 / 丁卓 陈建希 姚锦涛
Top Solder Mask Layer: 西南交通大学 / 听党指挥，独轮不倒 / 丁卓 陈建希 姚锦涛
Top Silkscreen Layer: 5v | - | + | tof
